# EAGLE design adruinoIO (EAGLE 6.6.0)
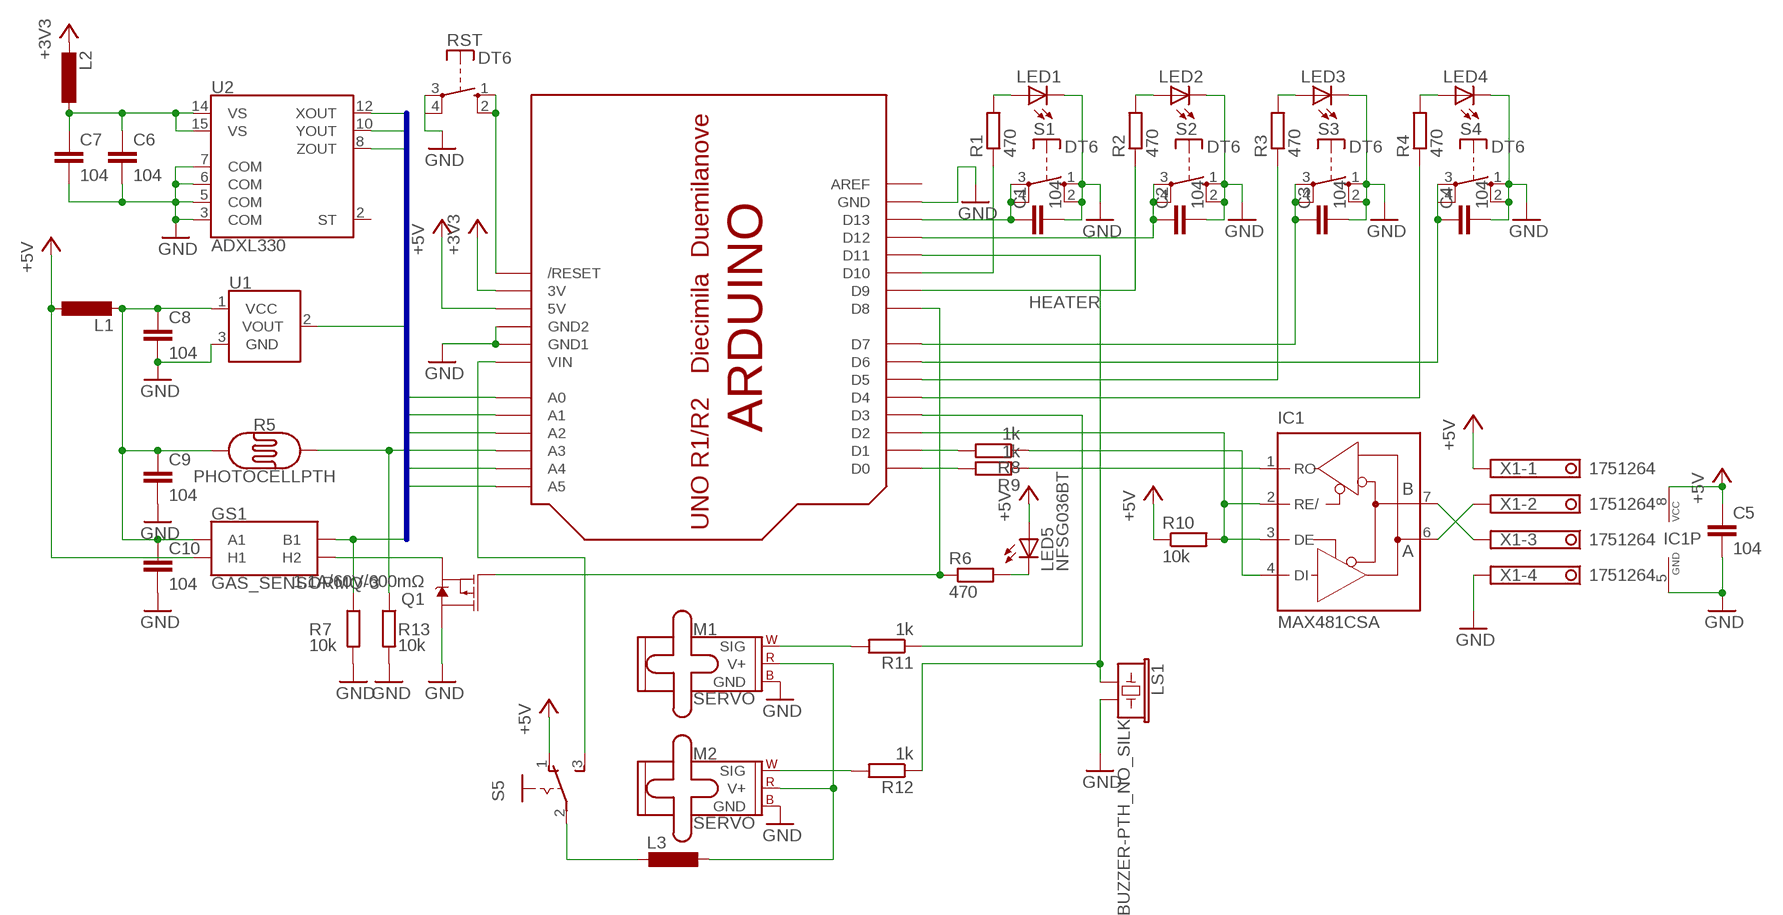
[diagram p0: schematic, sheet 1]

## Parts
C1  104  C-EUC1206  [C1206]
C2  104  C-EUC1206  [C1206]
C3  104  C-EUC1206  [C1206]
C4  104  C-EUC1206  [C1206]
C5  104  C-EUC1206  [C1206]
C6  104  C-EUC1206  [C1206]
C7  104  C-EUC1206  [C1206]
C8  104  C-EUC1206  [C1206]
C9  104  C-EUC1206K  [C1206K]
C10  104  C-EUC1206  [C1206]
GS1  GAS_SENSORMQ-3  [GAS_SENSOR]
IC1  MAX481CSA  [SO08]
L1  L-EUL2012C  [L2012C]
L2  L-EUL2012C  [L2012C]
L3  L-EUL2012C  [L2012C]
LED1  NFSG036BT  [NFSG036BT]
LED2  NFSG036BT  [NFSG036BT]
LED3  NFSG036BT  [NFSG036BT]
LED4  NFSG036BT  [NFSG036BT]
LED5  NFSG036BT  [NFSG036BT]
LS1  BUZZER-PTH_NO_SILK  [BUZZER-12MM-NS]
M1  SERVO  [1X03]
M2  SERVO  [1X03]
Q1  1.1A/60V/600mΩ  MOSFET_PCH-SI2309DS  [SOT23-3]
R1  470  R-EU_R1206  [R1206]
R2  470  R-EU_R1206  [R1206]
R3  470  R-EU_R1206  [R1206]
R4  470  R-EU_R1206  [R1206]
R5  PHOTOCELLPTH  [PHOTOCELL]
R6  470  R-EU_R1206  [R1206]
R7  10k  R-EU_R1206  [R1206]
R8  1k  R-EU_R1206  [R1206]
R9  1k  R-EU_R1206  [R1206]
R10  10k  R-EU_R1206  [R1206]
R11  1k  R-EU_R1206  [R1206]
R12  1k  R-EU_R1206  [R1206]
R13  10k  R-EU_R1206  [R1206]
RST  DT6  [DT6]
S1  DT6  [DT6]
S2  DT6  [DT6]
S3  DT6  [DT6]
S4  DT6  [DT6]
S5  255SB  [255SB]
U1  TMP36GT9  [TO-92]
U2  ADXL330  [LFCSP-16-4X4]
U$1  ARDUINO-NOHOLE  [ARDUINO-NOHOLE]
X1  1751264  [1751264]

## Nets
5V_R: C8.1 C9.1 C10.1 GS1.A1 L1.2 R5.1 U1.1(VCC)
+3V3: L2.2 U$1.3V
+5V: C5.1 GS1.HA(H1) IC1.8(VCC) L1.1 LED5.A R10.1 S5.1(O) U$1.5V X1.1
A0: R5.2 R13.1 U$1.A0
A1: U1.2(VOUT) U$1.A1
A2: GS1.B1 R7.1 U$1.A2
A3: U2.8(ZOUT) U$1.A3
A4: U2.10(YOUT) U$1.A4
A5: U2.12(XOUT) U$1.A5
BUZER: LS1.+ R12.1 U$1.D11
GND: C1.2 C2.2 C3.2 C4.2 C5.2 C6.2 C7.2 C8.2 C9.2 C10.2 IC1.5(GND) LED1.C LED2.C LED3.C LED4.C LS1.- M1.3(GND) M2.3(GND) Q1.3(D) R7.2 R13.2 RST.3(P) RST.4(P) S1.1(S) S1.2(S) S2.1(S) S2.2(S) S3.1(S) S3.2(S) S4.1(S) S4.2(S) U1.3(GND) U2.3(COM) U2.5(COM) U2.6(COM) U2.7(COM) U$1.GND U$1.GND1 U$1.GND2 X1.4
HEATER: Q1.1(G) R6.1 U$1.D8
LED1: R1.1 U$1.D10
LED2: R2.1 U$1.D9
LED3: R3.1 U$1.D5
LED4: R4.1 U$1.D4
N$1: L3.2 S5.2(P)
N$2: IC1.7(B) X1.3
N$3: IC1.6(A) X1.2
N$5: LED1.A R1.2
N$6: LED2.A R2.2
N$7: LED3.A R3.2
N$8: LED4.A R4.2
N$11: LED5.C R6.2
N$22: GS1.HB(H2) Q1.2(S)
N$25: M1.1(SIG) R11.2
N$26: M2.1(SIG) R12.2
N$27: C6.1 C7.1 L2.1 U2.14(VS) U2.15(VS)
RESET: RST.1(S) RST.2(S) U$1.RESET(/RESET)
RS485_DE: IC1.2(RE/) IC1.3(DE) R10.2 U$1.D2
RS485_TX: IC1.4(DI) R8.1
RS485RX: IC1.1(RO) R9.1
RX: R9.2 U$1.D0
SERVO1: R11.1 U$1.D3
SW1: C1.1 S1.3(P) S1.4(P) U$1.D13
SW2: C2.1 S2.3(P) S2.4(P) U$1.D12
SW3: C3.1 S3.3(P) S3.4(P) U$1.D7
SW4: C4.1 S4.3(P) S4.4(P) U$1.D6
TX: R8.2 U$1.D1
V_IN: S5.3(S) U$1.VIN
V_SERVO: L3.1 M1.2(V+) M2.2(V+)
Unconnected: U2.2(ST) U$1.AREF

## Buses
A[0..5]

## Library data of the parts
C1-C10 = rcl:C-EU: CAPACITOR, European symbol
GS1 = SparkFun-Sensors:GAS_SENSOR: Gas Sensors - MQ-3, MQ-4, MQ-6, MQ-7, MQ-8 Through-hole gas sensors with a heating coil and an analog output. Example Datasheet <https://cdn.sparkfun.com/datasheets/Sensors/Biometric/MQ-3%20ver1.3%20-%20Manual.pdf> SparkFun Products Gas Sensor Breakout Board <https://www.sparkfun.com/products/8891> (BOB-8891) - Breakout board compatible with all gas sensors. Alcohol Gas Sensor - MQ-3 <https://www.sparkfun.com/products/8880> (SEN-08880) Methane CNG Gas Sensor - MQ-4 <https://www.sparkfun.com/products/9404> (SEN-09404) LPG Gas Sensor - MQ-6 <https://www.sparkfun.com/products/9405> (SEN-09405) Carbon Monoxide Sensor - MQ-7 <https://www.sparkfun.com/products/9403> (SEN-09403) Hydrogen Gas Sensor - MQ-8 <https://www.sparkfun.com/products/10916> (SEN-10916); PROD_ID: COMP-12216; SF_ID: SEN-08880
IC1 = maxim:MAX481CSA: RS485 TRANSEIVER; MF: MAXIM; MPN: MAX481CSA; OC_FARNELL: unknown; OC_NEWARK: 90C3817
L1-L3 = rcl:L-EU: INDUCTOR, European symbol
LED1-LED5 = led:NFSG036BT: CHIP TYPE GREEN LED NFSx036xT Source: NICHIA CORPORATION .. NFSG036BT-E.pdf
LS1 = SparkFun-Electromechanical:BUZZER: Buzzer Small round buzzers that operate around the audible 2kHz range. You can use these as speakers to create simple music or user interfaces. Variant Overview: PTH - Mini Speaker - PC Mount 12mm 2.048kHz <https://www.sparkfun.com/products/7950> PTH_KIT - Mini Speaker - PC Mount 12mm 2.048kHz <https://www.sparkfun.com/products/7950> KIT simplifies soldering by adding stop mask to one side of the pads. PTH_NO_SILK - Mini Speaker - PC Mount 12mm 2.048kHz <https://www.sparkfun.com/products/7950> No silkscreen indicator of buzzer outline. PTH_KIT_NO_SILK - Mini Speaker - PC Mount 12mm 2.048kHz <https://www.sparkfun.com/products/7950> KIT package w/o silkscreen SMD - Buzzer Audio Magnetic (CCV-084B16) SMD buzzer used on, e.g. the LilyPad Buzzer <https://www.sparkfun.com/products/8463> and RFID USB Reader <https://www.sparkfun.com/products/9963>. SMD_KIT - Buzzer Audio Magnetic (CCV-084B16) SMD Buzzer with elongated pins to make soldering easier. Used on the SparkFun Simon Says - Surface Mount Soldering Kit <https://www.sparkfun.com/products/10935>.; PROD_ID: COMP-08253; SF_SKU: COM-07950
M1 M2 = SparkFun-Electromechanical:SERVO: Servo Motor 3-pin connector for a standard servo motor (voltage supply, ground, and control signal.) SparkFun Products Servo - Generic (Sub-Micro Size) <https://www.sparkfun.com/products/9065> (ROB-09065) Servo - Generic High Torque Continuous Rotation (Standard Size) <https://www.sparkfun.com/products/9347> (ROB-09347) Servo - Generic High Torque (Standard Size) <https://www.sparkfun.com/products/11965> (ROB-11965)
Q1 = SparkFun-DiscreteSemi:MOSFET_PCH: P-channel MOSFETs Voltage controlled devices that allow control of high current outputs. SparkFun Products: SparkFun ESP32 Thing <https://www.sparkfun.com/products/13907> SparkFun ESP8266 Thing <https://www.sparkfun.com/products/13231>; PROD_ID: TRANS-08285
R1-R4 R6-R13 = rcl:R-EU_: RESISTOR, European symbol
R5 = SparkFun-Sensors:PHOTOCELL: Photocell (Photodetector, Photo Resistor, CdS) This is a very small light sensor. A photocell changes (also called a photodetector, photo resistor, CdS or photoconductive cell) resistance depending on the amount of light it is exposed to. These little sensors make great ambient light triggers (when light in the room turns on, do something). Datasheet <http://cdn.sparkfun.com/datasheets/Sensors/LightImaging/SEN-09088.pdf> SparkFun Products Mini Photocell <https://www.sparkfun.com/products/9088> (SEN-09088); PROD_ID: COMP-09129; SF_ID: SEN-09088
RST S1-S4 = switch-misc:DT: ITT SWITCH
S5 = switch:255SB: SLIDING SWITCH Distributor Buerklin, 11G810
U1 = SparkFun-Sensors:TMP36: TMP36 Precision Analog °C Temperature Sensor The TMP36 is a low voltage, precision centigrade temperature sensor. It provides a voltage output that is linearly proportional to the Celsius temperature. It also doesn’t require any external calibration to provide typical accuracies of ±1°C at +25°C and ±2°C over the −40°C to +125°C temperature range. We like it because it’s so easy to use: Just give the device a ground and 2.7 to 5.5 VDC and read the voltage on the Vout pin. The output voltage can be converted to temperature easily using the scale factor of 10 mV/°C. Datasheet <http://cdn.sparkfun.com/datasheets/Sensors/Temp/TMP35_36_37.pdf> SparkFun Products Temperature Sensor - TMP36 <https://www.sparkfun.com/products/10988> (SEN-10988) SparkFun Danger Shield <https://www.sparkfun.com/products/11649> (DEV-11649); PROD_ID: IC-09880; SF_ID: SEN-10988
U2 = SparkFun-Sensors:ADXL330: Analog Devices ADXL330 3-Axis Analog Accelerometer The ADXL330 is a small, thin, low power, complete 3-axis accelerometer with signal conditioned voltage outputs, all on a single monolithic IC. The product measures acceleration with a minimum full-scale range of ±3g. It can measure the static acceleration of gravity in tilt-sensing applications, as well as dynamic acceleration resulting from motion, shock, or vibration. Datasheet <https://www.sparkfun.com/datasheets/Components/ADXL330_0.pdf> SparkFun Products Triple Axis Accelerometer Breakout - ADXL330 <https://www.sparkfun.com/products/retired/692> (SEN-00692); PROD_ID: IC-08189
U$1 = adafruit:ARDUINO: Arduino Diecimila/Duemilanove Make a shield with ease, this package has all the named pins as well as the two mounting drill holes and an outline of the USB and DC power connector. The outline is on the DIMENSION layer, so if your board house uses it they will cut the outline to match. http://www.ladyada.net/library/pcb/eaglelibrary.html
X1 = con-phoenix-350:1751264: MKDS 1/ 4-3,5 Printklemme Nennstrom: 10 A Bemessungsspannung: 160 V Raster: 3,5 mm Polzahl: 4 Montageart: Löten Anschlussart: Schraubanschluss Anschlussrichtung vom Leiter zur Platine: 0° Source: http://eshop.phoenixcontact.com .. 1751264.pdf; MPN: 1751264; OC_FARNELL: unknown; OC_NEWARK: 10R0934

## Board
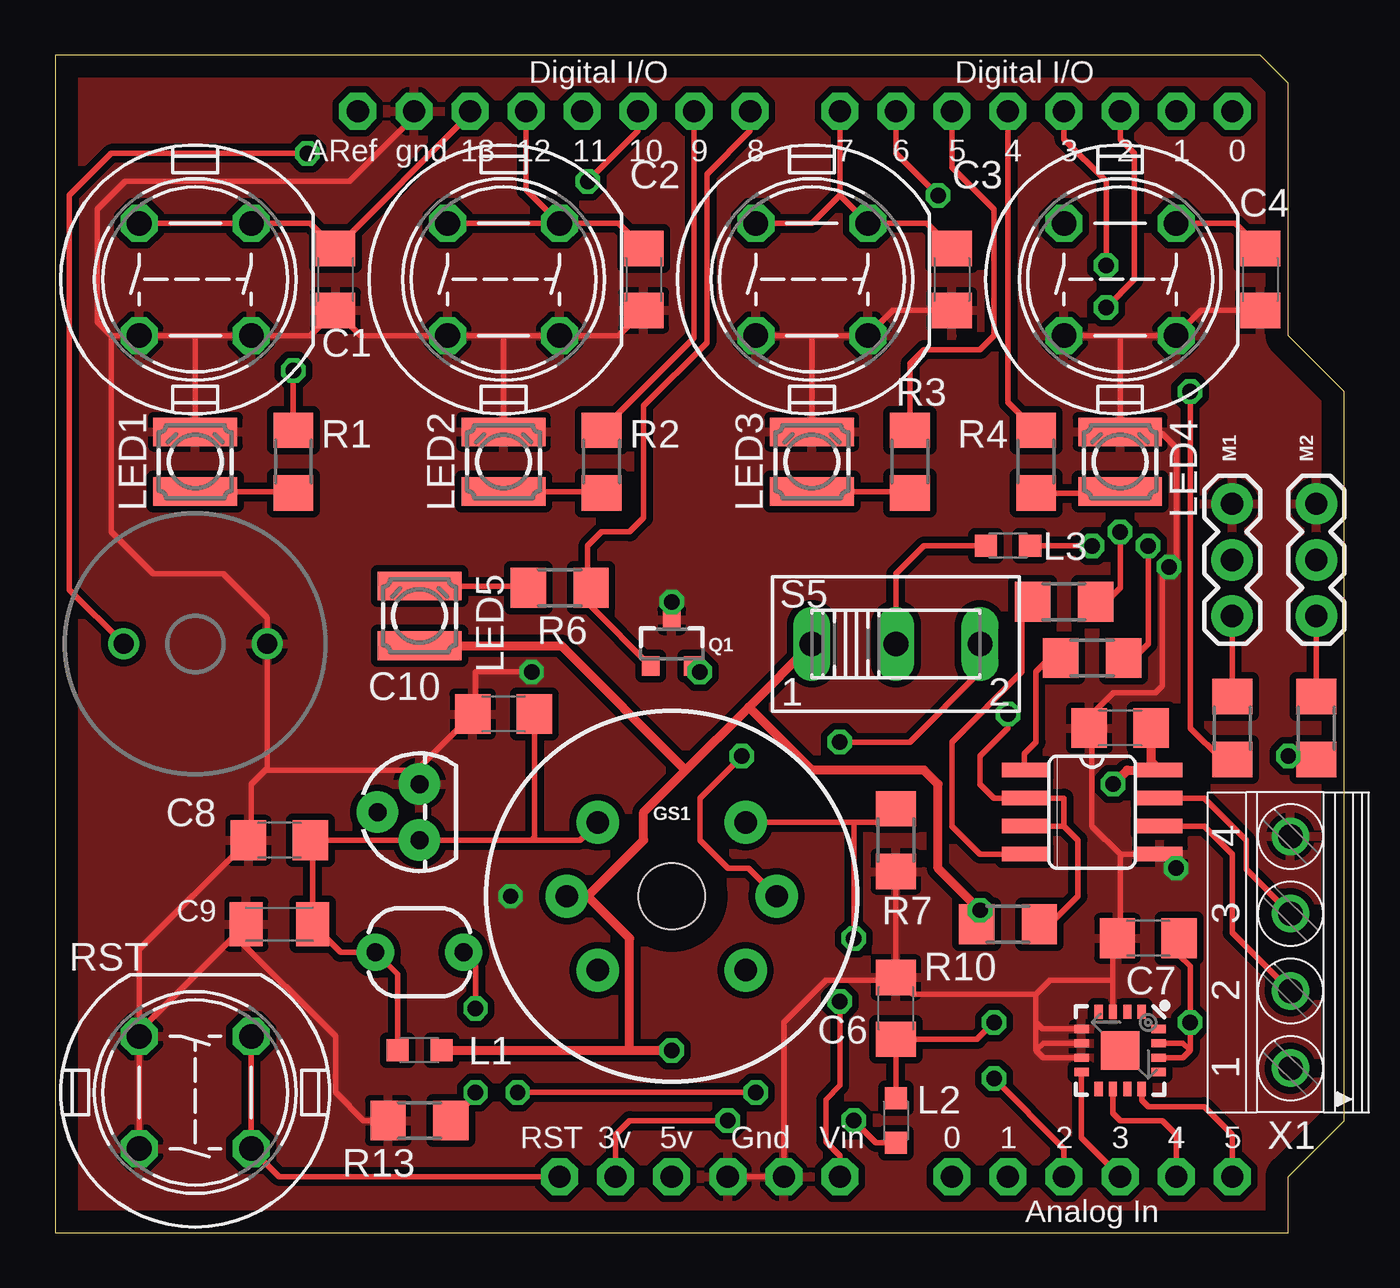
[diagram p1: board, top side]
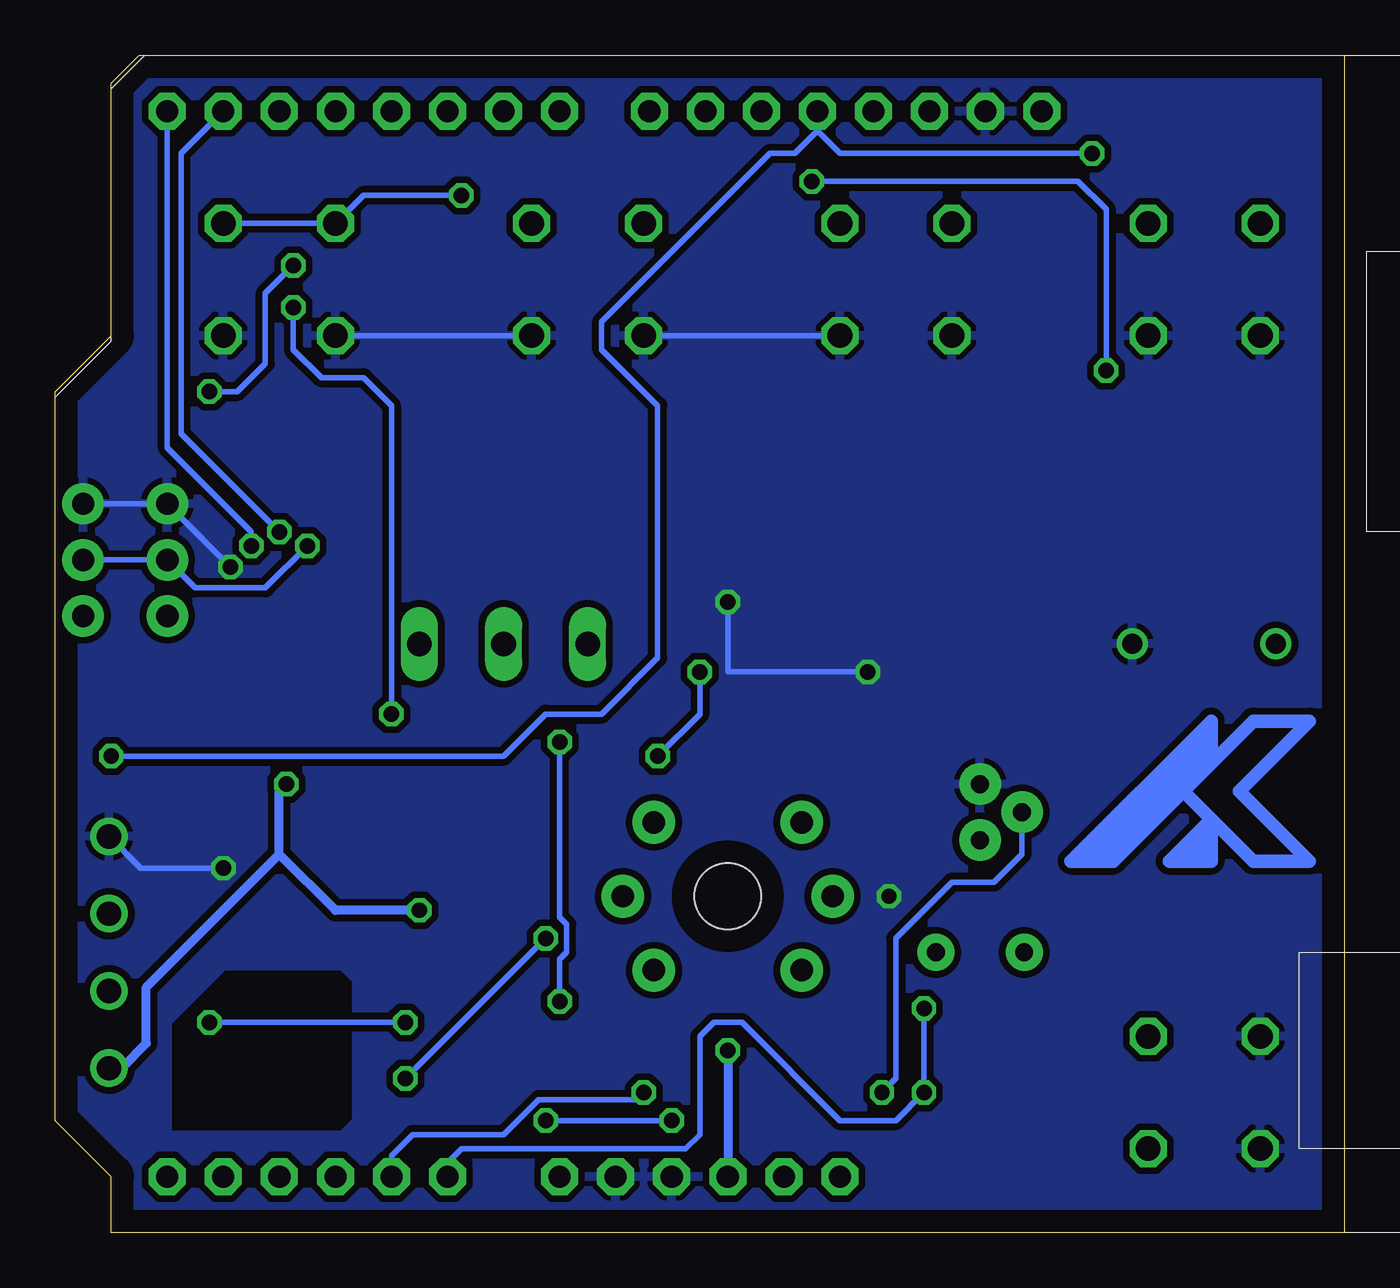
[diagram p2: board, bottom side, seen from below]

Size 58.42 x 53.34 mm. Coordinates in mm from the lower left corner, seen from the top.
Outline: 0,53.34 0,0 55.88,0 55.88,2.54 58.42,5.08 58.42,38.1 55.88,40.64 55.88,52.07 54.61,53.34 0,53.34
Copper layers (1*16): Top 0.035mm / dielectric 1.5mm / Bottom 0.035mm
Design rules "default *": minimum track width 10mil, minimum drill 24mil, track to track 8mil, track to pad 8mil, pad to pad 8mil, via to via 8mil, smd to smd 0mil, copper to edge 40mil, drill to drill 8mil, minimum pad ring 10mil, minimum via ring 8mil, stop-mask expansion 4mil, vias tented up to drill 0mil, thermal gap 10mil

### Footprints (pad centres in the part's own frame; a part is rotated, then mirrored left to right if it is on the bottom)
C1206 = smd 1.6 x 1.8: 1 -1.4,0; 2 1.4,0
C1206K = smd 1.5 x 2: 1 -1.5,0; 2 1.5,0
GAS_SENSOR = drill 1.016 pad 1.93: A1 -3.35,3.35; A2 -3.35,-3.35; B1 3.35,3.35; B2 3.35,-3.35; HA -4.75,0; HB 4.75,0 | hole 3: 0,0
SO08 = smd 0.66 x 2.032: 1 -1.905,-3.073; 2 -0.635,-3.073; 3 0.635,-3.073; 4 1.905,-3.073; 5 1.905,3.073; 6 0.635,3.073; 7 -0.635,3.073; 8 -1.905,3.073
L2012C = smd 1 x 1: 1 -1,0; 2 1,0
NFSG036BT = smd 1.3 x 3.8: A 1.35,0; C -1.35,0
BUZZER-12MM-NS = drill 0.9: + 3.25,0; - -3.25,0
1X03 = drill 1.016 pad 1.88: 1 0,0; 2 2.54,0; 3 5.08,0
SOT23-3 = smd 0.8 x 0.9: 1 -0.95,-1; 2 0.95,-1; 3 0,1.1
R1206 = smd 1.6 x 1.803: 1 -1.422,0; 2 1.422,0
PHOTOCELL = drill 0.8 pad 1.676: 1 -2,0; 2 2,0
DT6 = drill 1.118 octagon: 1 -2.54,2.54; 2 2.54,2.54; 3 2.54,-2.54; 4 -2.54,-2.54
255SB = drill 1.118 long: 1 -3.81,0; 2 0,0; 3 3.81,0
TO-92 = drill 0.813 pad 1.88: 1 -1.27,0; 2 0,1.905; 3 1.27,0
LFCSP-16-4X4 = smd 1.75 x 1.75: 0 0,0 | smd 0.65 x 0.37: 1 -1.75,0.975; 2 -1.75,0.325; 3 -1.75,-0.325; 4 -1.75,-0.975; 9 1.75,-0.975; 10 1.75,-0.325; 11 1.75,0.325; 12 1.75,0.975 | smd 0.37 x 0.65: 5 -0.975,-1.75; 6 -0.325,-1.75; 7 0.325,-1.75; 8 0.975,-1.75; 13 0.975,1.75; 14 0.325,1.75; 15 -0.325,1.75; 16 -0.975,1.75
ARDUINO-NOHOLE = drill 1 pad 1.676 octagon: 3V 35.56,2.54; 5V 38.1,2.54; A0 50.8,2.54; A1 53.34,2.54; A2 55.88,2.54; A3 58.42,2.54; A4 60.96,2.54; A5 63.5,2.54; AREF 23.876,50.8; D0 63.5,50.8; D1 60.96,50.8; D2 58.42,50.8; D3 55.88,50.8; D4 53.34,50.8; D5 50.8,50.8; D6 48.26,50.8; D7 45.72,50.8; D8 41.656,50.8; D9 39.116,50.8; D10 36.576,50.8; D11 34.036,50.8; D12 31.496,50.8; D13 28.956,50.8; GND 26.416,50.8; GND1 43.18,2.54; GND2 40.64,2.54; RESET 33.02,2.54; VIN 45.72,2.54
1751264 = drill 1.1 pad 1.7: 1 -5.25,-0.1; 2 -1.75,-0.1; 3 1.75,-0.1; 4 5.25,-0.1

### Placement (x,y rotation side)
C1  12.7,43.18 270 top
C2  26.67,43.18 270 top
C3  40.64,43.18 270 top
C4  54.61,43.18 270 top
C5  48.26,22.86 180 top
C6  38.1,10.16 90 top
C7  49.53,13.33 180 top
C8  10.16,17.78 180 top
C9  10.16,13.97 180 top
C10  20.32,23.5 180 top
GS1  27.94,15.24 0 top
IC1  46.99,19.05 270 top
L1  16.51,8.26 180 top
L2  38.1,5.08 270 top
L3  43.18,31.12 180 top
LED1  6.35,34.93 270 top
LED2  20.32,34.93 270 top
LED3  34.29,34.93 270 top
LED4  48.26,34.93 270 top
LED5  16.51,27.94 270 top
LS1  6.35,26.67 180 top
M1  53.34,27.94 90 top
M2  57.15,27.94 90 top
Q1  27.94,26.67 0 top
R1  10.79,34.93 270 top
R2  24.77,34.93 270 top
R3  38.73,34.93 270 top
R4  44.45,34.93 270 top
R5  16.51,12.7 0 top
R6  22.86,29.21 180 top
R7  38.1,17.78 270 top
R8  45.72,28.58 0 top
R9  46.99,26.04 0 top
R10  43.18,13.97 0 top
R11  53.34,22.86 90 top
R12  57.15,22.86 90 top
R13  16.51,5.08 180 top
RST  6.35,6.35 270 top
S1  6.35,43.18 180 top
S2  20.32,43.18 180 top
S3  34.29,43.18 180 top
S4  48.26,43.18 180 top
S5  38.1,26.67 0 top
U1  16.51,19.05 90 top
U2  48.26,8.26 270 top
U$1  -10.16,0 0 top
U$2  [LOGO]  6.03,17.46 0 bottom
X1  55.88,12.7 90 top

### Tracks (layer width: path | path; a pad name or v marks a point on that pad's centre or on a via)
5V_R
  Top 0.254: 21.59,17.78 U1.1 C8.1 11.66,17.68 C9.1 12.93,12.7 R5.1 15.51,11.7 L1.2 | 21.59,17.78 23.78,17.78 GS1.A1 | C10.1 21.72,17.91 21.59,17.78
+3V3  (via drill 0.7)
  Top 0.254: U$1.3V 25.4,4.44 26.03,5.08 v30.48,5.08 | L2.2 37.2,4.08 v36.2,5.08
  Bottom 0.254: v30.48,5.08 v36.2,5.08
+5V  (via drill 0.7)
  Top 0.254: R10.1 41.76,14.45 v41.91,14.6
  Top 0.406: L1.1 26.03,8.26 | 26.03,8.26 v27.94,8.26 | GS1.HA 24.13,15.24 | 24.13,15.24 26.67,17.78 26.67,19.05 28.57,20.95 | 28.57,20.95 31.43,23.81 | 31.43,23.81 S5.1 | LED5.A 22.94,26.59 28.57,20.95 | 26.03,8.26 26.03,13.33 24.13,15.24 | C5.1 49.66,21.36 IC1.8 48.58,20.95 v47.94,20.32 | v41.91,14.6 40,16.51 40,20.32 39.37,20.95 34.29,20.95 31.43,23.81
  Bottom 0.406: v27.94,8.26 U$1.5V | X1.1 55.41,7.45 54.29,8.57 54.29,11.11 48.26,17.14 | 48.26,17.14 48.26,20 v47.94,20.32 | v41.91,14.6 45.72,14.6 48.26,17.14
A0  (via drill 0.7)
  Top 0.254: R5.2 18.51,12.6 19.05,12.06 v19.05,10.16 | v19.05,6.35 19.05,6.2 R13.1
  Bottom 0.254: v19.05,10.16 v19.05,6.35 20.32,5.08 22.86,5.08 27.3,9.53 28.57,9.53 29.21,8.89 29.21,4.44 29.84,3.81 40,3.81 40.64,3.17 U$1.A0
A1  (via drill 0.7)
  Top 0.254: v20.95,6.35 v31.75,6.35
  Bottom 0.254: U1.2 14.6,17.14 15.87,15.87 17.78,15.87 20.32,13.33 20.32,6.98 v20.95,6.35 | v31.75,6.35 32.07,6.03 36.51,6.03 38.1,4.44 42.23,4.44 43.18,3.49 U$1.A1
A2  (via drill 0.7)
  Top 0.254: GS1.B1 36.2,18.59 | 36.2,18.59 37.49,18.59 R7.1 | U$1.A2 45.72,3.81 v42.54,6.98 | v36.2,13.33 36.2,18.59
  Bottom 0.254: v42.54,6.98 v36.2,13.33
A3
  Top 0.254: U2.8 46.51,4.29 U$1.A3
A4
  Top 0.254: U2.10 47.93,5.4 48.26,5.08 50.16,5.08 50.8,4.44 U$1.A4
A5
  Top 0.254: U2.12 49.23,6.01 49.53,5.71 52.07,5.71 53.34,4.44 U$1.A5
BUZER  (via drill 0.7)
  Top 0.254: v11.43,48.9 2.54,48.9 0.63,46.99 0.63,29.13 LS1.+ | R12.1 56.03,21.44 v55.88,21.59
  Bottom 0.254: U$1.D11 23.88,49.91 | 23.88,49.91 22.86,48.9 v11.43,48.9 | v55.88,21.59 38.1,21.59 36.2,23.5 33.66,23.5 31.11,26.04 31.11,37.47 33.66,40.01 33.66,41.27 26.03,48.9 24.89,48.9 23.88,49.91
GND  (via drill 0.7)
  Top 0.254: C3.2 37.97,41.78 S3.1 34.29,40.64 | C4.2 51.94,41.78 S4.1 48.26,40.64 | U$1.GND 16.26,50.55 13.33,47.62 3.17,47.62 1.9,46.36 1.9,41.27 2.54,40.64 | 2.54,40.64 2.54,31.75 4.44,29.84 7.62,29.84 9.6,27.87 LS1.- 9.6,21.03 9.53,20.95 | 9.53,20.95 8.89,20.32 8.89,17.91 C8.2 3.81,12.83 RST.4 | 9.53,20.95 15.87,20.95 U1.3 16.51,21.09 C10.2 19.05,23.5 19.05,25.4 v21.59,25.4 | RST.3 RST.4 | RST.4 3.81,9.53 | RST.4 3.81,9.12 8.14,13.45 | 8.14,13.45 C9.2 | R13.2 13.97,5.08 12.7,6.35 12.7,8.89 8.14,13.45 | U2.3 47.93,11.43 | 47.93,11.43 47.93,13.14 C7.2 48.26,13.46 48.26,17.14 | U$1.GND2 U$1.GND1 33.02,9.53 34.92,11.43 37.97,11.43 C6.2 | R7.2 C6.2 | Q1.3 v27.94,28.58 | U2.7 44.77,7.93 44.45,8.26 | U2.6 44.77,8.58 44.45,8.26 | U2.5 44.74,9.23 44.45,9.53 | 44.45,9.53 44.45,8.26 | 44.45,9.53 44.45,10.79 | 44.45,10.79 45.09,11.43 47.93,11.43 | 44.45,10.79 38.86,10.79 C6.2 | 48.26,17.14 IC1.5 50.16,17.14 v50.8,16.51 | 48.26,17.14 46.99,18.41 46.99,22.73 C5.2 46.86,23.37 47.94,24.45 49.85,24.45 50.16,24.77 50.16,29.84 v50.48,30.16 50.8,30.48 50.8,35.56 50.16,36.2 48.9,36.2 | 48.9,36.2 48.34,36.2 LED4.C | 6.35,40.64 S1.1 11.56,40.64 C1.2 13.84,40.64 S2.2 20.32,40.64 | 6.35,40.64 S1.2 2.54,40.64 | LED1.C 6.35,40.64 | 20.32,40.64 S2.1 25.53,40.64 C2.2 | LED2.C 20.32,40.64 | S3.2 34.29,40.64 | LED3.C 34.29,40.64 | S4.2 48.26,40.64 | 48.9,36.2 48.26,36.83 48.26,40.64
  Bottom 0.254: S3.2 S2.1 | S4.2 S3.1 | v27.94,28.58 27.94,25.4 v21.59,25.4 | v50.8,16.51 54.54,16.51 X1.4 | M2.3 M1.3 v50.48,30.16
  other vias: 20.64,15.24
  pour Bottom (isolate 0.305): 0.32,53.34 0.32,0 53.02,0 53.02,4.44 45.4,4.44 44.77,5.08 44.77,11.43 45.4,12.06 50.8,12.06 53.34,9.53 53.34,0 55.88,0 55.88,2.54 58.42,5.08 58.42,37.78 55.88,40.32 55.88,51.75 54.29,53.34
  pour Top (isolate 0.305): 0.32,53.34 54.29,53.34 55.88,51.75 55.88,40.32 58.42,37.78 58.42,5.08 55.88,2.54 55.88,0 0.32,0
HEATER
  Top 0.254: U$1.D8 31.5,49.91 29.53,47.94 29.53,40.32 26.67,37.47 26.67,32.38 26.03,31.75 24.77,31.75 24.13,31.12 24.13,29.36 R6.1 24.28,28.38 Q1.1
LED1  (via drill 0.7)
  Top 0.254: U$1.D10 26.42,49.91 v24.13,47.62 | v10.79,39.05 R1.1
  Bottom 0.254: v24.13,47.62 12.06,47.62 10.79,46.36 v10.79,39.05
LED2
  Top 0.254: U$1.D9 28.96,40.54 R2.1
LED3
  Top 0.254: U$1.D5 40.64,48.26 42.54,46.36 42.54,40.64 41.91,40.01 39.37,40.01 38.73,39.37 R3.1
LED4
  Top 0.254: U$1.D4 43.18,37.62 R4.1
N$1
  Top 0.254: S5.2 38.1,29.84 39.37,31.12 L3.2
N$2
  Top 0.254: IC1.7 52.07,19.69 53.98,17.78 53.98,16.45 X1.3
N$3
  Top 0.254: IC1.6 52.07,18.41 53.34,17.14 53.34,13.59 X1.2
N$5
  Top 0.254: LED1.A 10.72,33.58 R1.2
N$6
  Top 0.254: LED2.A 24.69,33.58 R2.2
N$7
  Top 0.254: LED3.A 38.66,33.58 R3.2
N$8
  Top 0.254: R4.2 48.19,33.5 LED4.A
N$11
  Top 0.254: LED5.C 21.36,29.29 R6.2
N$22  (via drill 0.7)
  Top 0.254: Q1.2 28.89,25.72 v29.21,25.4 | v31.11,21.59 29.21,19.69 29.21,17.78 30.48,16.51 31.42,16.51 GS1.HB
  Bottom 0.254: v29.21,25.4 29.21,23.5 v31.11,21.59
N$25
  Top 0.254: R11.2 M1.1
N$26
  Top 0.254: R12.2 M2.1
N$27  (via drill 0.7)
  Top 0.254: U2.14 51.11,7.93 51.43,8.26 | U2.15 51.11,8.58 51.43,8.26 | C7.1 50.93,12.57 51.43,12.06 51.43,10.16 v51.43,9.53 51.43,8.26 | L2.1 C6.1 41.78,8.76 v42.54,9.53
  Bottom 0.254: v42.54,9.53 v51.43,9.53
RESET
  Top 0.254: U$1.RESET 10.16,2.54 RST.2 RST.1
RS485_DE  (via drill 0.7)
  Top 0.254: R10.2 45.09,13.97 46.35,15.24 46.35,17.78 45.72,18.41 | 45.72,18.41 IC1.3 | 45.72,18.41 45.72,19.69 IC1.2 42.54,19.69 41.91,20.32 41.91,21.59 43.18,22.86 v43.18,23.5 | U$1.D2 48.26,49.53 48.9,48.9 48.9,43.18 v47.62,41.91
  Bottom 0.254: v47.62,41.91 47.62,40.01 46.35,38.73 44.45,38.73 43.18,37.47 v43.18,23.5
RS485_TX
  Top 0.254: IC1.4 41.91,17.14 40.64,18.41 40.64,22.23 43.81,25.4 43.81,28.09 R8.1 44.45,28.58
RS485RX
  Top 0.254: IC1.1 43.92,21.69 44.45,22.23 44.45,25.4 45.09,26.04 R9.1
RX  (via drill 0.7)
  Top 0.254: R9.2 48.9,26.04 49.53,26.67 v49.53,31.12
  Bottom 0.254: v49.53,31.12 49.53,31.75 53.34,35.56 U$1.D0
SERVO1  (via drill 0.7)
  Top 0.254: R11.1 52.86,21.44 51.43,22.86 v51.43,38.1 | v47.62,43.81 47.62,47.62 45.72,49.53 U$1.D3
  Bottom 0.254: v51.43,38.1 50.16,38.1 48.9,39.37 48.9,42.55 v47.62,43.81
SW1
  Top 0.254: U$1.D13 18.8,50.68 C1.1 11.56,45.72 S1.4 S1.3
SW2
  Top 0.254: C2.1 25.53,45.72 S2.4 | U$1.D12 21.34,47.24 S2.4 | S2.3 S2.4
SW3
  Top 0.254: C3.1 39.5,45.72 S3.4 35.56,46.99 | U$1.D7 35.56,46.99 | S3.3 34.29,45.72 35.56,46.99
SW4  (via drill 0.7)
  Top 0.254: C4.1 53.47,45.72 S4.4 | U$1.D6 38.1,48.9 v40,46.99
  Bottom 0.254: v40,46.99 44.45,46.99 S4.3 S4.4
TX  (via drill 0.7)
  Top 0.254: R8.2 47.62,28.58 48.26,29.21 v48.26,31.75
  Bottom 0.254: v48.26,31.75 52.7,36.2 52.7,48.9 U$1.D1
V_IN  (via drill 0.7)
  Top 0.254: U$1.VIN 35.56,3.49 34.92,4.13 34.92,6.03 35.56,6.67 v35.56,10.48 | v35.56,22.23 38.73,22.23 41.91,25.4 S5.3
  Bottom 0.254: v35.56,10.48 35.56,12.38 35.24,12.7 35.24,13.97 35.56,14.29 v35.56,22.23
V_SERVO  (via drill 0.7)
  Top 0.254: L3.1 v46.99,31.12
  Bottom 0.254: v46.99,31.12 48.9,29.21 52.07,29.21 M1.2 M2.2

### Text on the board
tValues: Adam Kaliszan | 2017